# Altium schematic sheet Circuits_task.SchDoc
size A
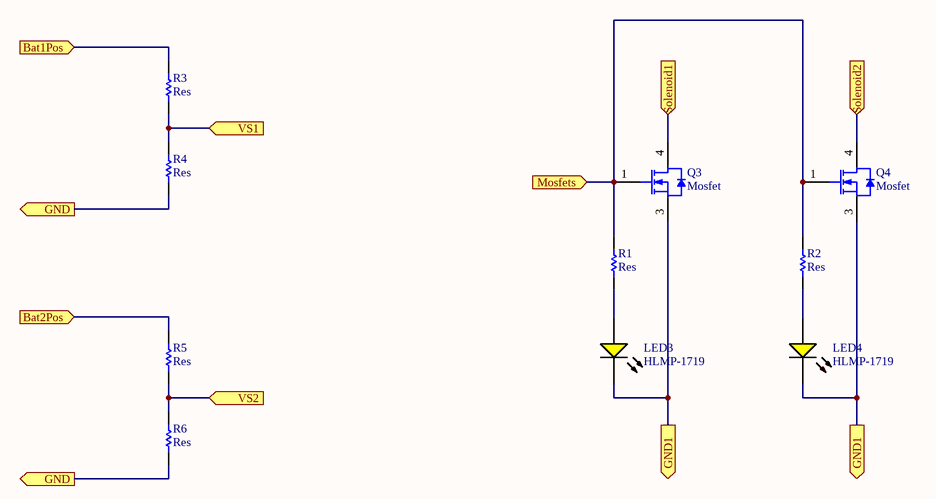
[diagram p0: Circuits_task.SchDoc]

## Parts
LED3  HLMP-1719  [AVAG-HLMP-1719_V]
LED4  HLMP-1719  [AVAG-HLMP-1719_V]
Q3  Mosfet  [ONSC-DPAK-3-369AA-01_V]
Q4  Mosfet  [ONSC-DPAK-3-369AA-01_V]
R1  Res  [RESC1005X40X25LL05T10]
R2  Res  [RESC1005X40X25LL05T10]
R3  Res  [RESC1005X40X25LL05T10]
R4  Res  [RESC1005X40X25LL05T10]
R5  Res  [RESC1005X40X25LL05T10]
R6  Res  [RESC1005X40X25LL05T10]

## Ports
Bat1Pos (in), Bat2Pos (in), GND1 (out), GND (out), Mosfets (in), Solenoid1 (in), Solenoid2 (in), VS1 (in), VS2 (in)

## Nets
Bat1Pos: R3.2 ; port Bat1Pos
Bat2Pos: R5.2 ; port Bat2Pos
GND: R4.1 R6.1 ; port GND
GND1: LED3.2(K) LED4.2(K) Q3.3(S) Q4.3(S) ; port GND1
Mosfets: Q3.1(G) Q4.1(G) R1.2 R2.2 ; port Mosfets
Solenoid1: Q3.4(D) ; port Solenoid1
Solenoid2: Q4.4(D) ; port Solenoid2
VS1: R3.1 R4.2 ; port VS1
VS2: R5.1 R6.2 ; port VS2
NetLED3_1: LED3.1(A) R1.1
NetLED4_1: LED4.1(A) R2.1

## Library data of the parts
LED3 LED4 = CMP-2000-06410-1: Low Current LED Lamp, T-1 (3 mm), 1.8 V, 2 mA, -40 to 100 degC, 2-Pin THD, RoHS, Bulk; Manufacturer: AvagoTechnologies; Type: Uni-Color; Viewing Angle: 50°; Color: Yellow; Lens Shape Type: Circular; Number of LEDs: 1; Intensity: 2.1mcd; Mounting Orientation: TopMount; Dominant Wavelength/Color Temperature: 585nm; Lens Appearance: ColoredDiffused; Manufacturer URL: http://www.avagotech.com/; Mounting Technology: ThroughHole; Pin Count: 2; Datasheet URL: http://www.avagotech.com/docs/AV02-1557EN; Package: 2T-1; Packaging: Bulk; Package Description: 2-Pin Through Hole Device, Body Dia 3.175 mm; Category: LEDs; Mounting: ThroughHole; Datasheet Version: 07/2014; Package Reference: HLMP-1719
Q3 Q4 = CMP-1058-00321-1: Power MOSFET, 25 V, 65 A, Single N-Channel, 3-Pin DPAK, Pb-Free, Tape and Reel; PartNumber: NTD4860NT4G; Manufacturer: On Semiconductor; VGS Max (V): 20; Ciss Typ (pF): 1308; Coss Typ (pF): 342; Qrr Typ (nC): 3.5; VGS(th) Max (V): 2.5; Channel Polarity: N Channel; V(BR)DSS Min (V): 25; ID Max (A): 65; Crss Typ (pF): 169; ComponentLink1Description: Manufacturer URL; Configuration: Single; ComponentLink2Description: Datasheet; DatasheetVersion: Rev. 1; PackageDescription: 3-Pin Flange Mount, Body 6.54 x 6.095 mm, Pitch 2.29 mm; Packing: Tape and Reel; ComponentLink3URL: http://www.onsemi.cn/pub_link/Collateral/369AA.PDF; Package Type: DPAK-3; PackageReference: DPAK-3-369AA-01; ComponentLink2URL: http://www.onsemi.cn/pub_link/Collateral/NTD4860N.PDF; Mounting Technology: Surface Mount; RoHS: Pb-Free; ComponentLink1URL: http://www.onsemi.com/; PackageVersion: Rev. B, 06/2010; ComponentLink3Description: Package Specification
R1-R6 = CMP-2002-06514-1: Manufacturer: Multicomp; Part Number: MCMR04X1203FTL